# EAGLE schematic Sensor Gabung (EAGLE 7.2.0)

## Sheet 1 of 9
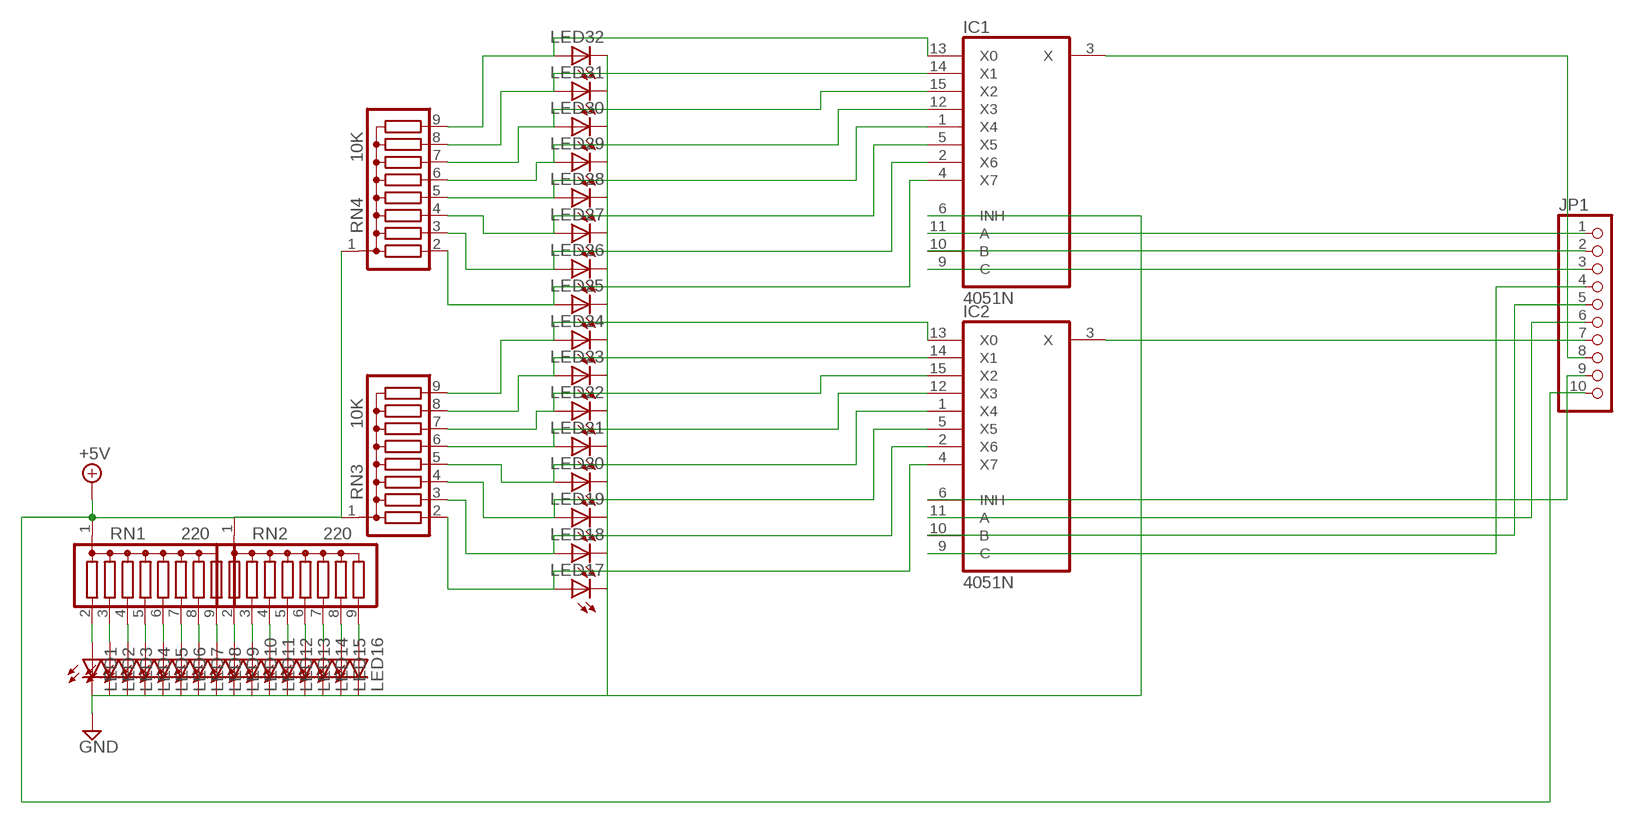
[diagram p0: schematic, sheet 1]

### Parts
IC1  4051N  [DIL16]
IC2  4051N  [DIL16]
JP1  PINHD-1X10  [1X10]
LED1  LED3MM  [LED3MM]
LED2  LED3MM  [LED3MM]
LED3  LED3MM  [LED3MM]
LED4  LED3MM  [LED3MM]
LED5  LED3MM  [LED3MM]
LED6  LED3MM  [LED3MM]
LED7  LED3MM  [LED3MM]
LED8  LED3MM  [LED3MM]
LED9  LED3MM  [LED3MM]
LED10  LED3MM  [LED3MM]
LED11  LED3MM  [LED3MM]
LED12  LED3MM  [LED3MM]
LED13  LED3MM  [LED3MM]
LED14  LED3MM  [LED3MM]
LED15  LED3MM  [LED3MM]
LED16  LED3MM  [LED3MM]
LED17  LED3MM  [LED3MM]
LED18  LED3MM  [LED3MM]
LED19  LED3MM  [LED3MM]
LED20  LED3MM  [LED3MM]
LED21  LED3MM  [LED3MM]
LED22  LED3MM  [LED3MM]
LED23  LED3MM  [LED3MM]
LED24  LED3MM  [LED3MM]
LED25  LED3MM  [LED3MM]
LED26  LED3MM  [LED3MM]
LED27  LED3MM  [LED3MM]
LED28  LED3MM  [LED3MM]
LED29  LED3MM  [LED3MM]
LED30  LED3MM  [LED3MM]
LED31  LED3MM  [LED3MM]
LED32  LED3MM  [LED3MM]
RN1  220  G08R  [SIL9]
RN2  220  G08R  [SIL9]
RN3  10K  G08R  [SIL9]
RN4  10K  G08R  [SIL9]

### Nets
+5V: JP1.10 RN1.1 RN2.1 RN3.1 RN4.1 ; also sheet 2,7,8,9
GND: IC1.6(INH) IC2.6(INH) JP1.9 LED1.K(C) LED2.K(C) LED3.K(C) LED4.K(C) LED5.K(C) LED6.K(C) LED7.K(C) LED8.K(C) LED9.K(C) LED10.K(C) LED11.K(C) LED12.K(C) LED13.K(C) LED14.K(C) LED15.K(C) LED16.K(C) LED17.K(C) LED18.K(C) LED19.K(C) LED20.K(C) LED21.K(C) LED22.K(C) LED23.K(C) LED24.K(C) LED25.K(C) LED26.K(C) LED27.K(C) LED28.K(C) LED29.K(C) LED30.K(C) LED31.K(C) LED32.K(C) ; also sheet 2,7,9
N$1: IC1.10(B) JP1.2
N$2: IC1.9(C) JP1.3
N$3: IC2.11(A) JP1.6
N$4: IC2.10(B) JP1.5
N$5: IC2.9(C) JP1.4
N$6: IC2.3(X) JP1.7
N$15: LED1.A RN1.2
N$16: LED2.A RN1.3
N$17: IC2.4(X7) LED17.A RN3.2
N$18: IC2.2(X6) LED18.A RN3.3
N$19: IC2.5(X5) LED19.A RN3.4
N$20: IC2.1(X4) LED20.A RN3.5
N$21: IC2.12(X3) LED21.A RN3.6
N$22: IC2.15(X2) LED22.A RN3.7
N$23: IC2.14(X1) LED23.A RN3.8
N$24: IC2.13(X0) LED24.A RN3.9
N$25: IC1.4(X7) LED25.A RN4.2
N$26: IC1.2(X6) LED26.A RN4.3
N$27: IC1.5(X5) LED27.A RN4.4
N$28: IC1.1(X4) LED28.A RN4.5
N$29: IC1.12(X3) LED29.A RN4.6
N$30: IC1.15(X2) LED30.A RN4.7
N$31: IC1.14(X1) LED31.A RN4.8
N$32: IC1.13(X0) LED32.A RN4.9
N$33: LED3.A RN1.4
N$34: LED4.A RN1.5
N$35: LED5.A RN1.6
N$36: LED6.A RN1.7
N$37: LED7.A RN1.8
N$38: LED8.A RN1.9
N$39: LED9.A RN2.2
N$40: LED10.A RN2.3
N$41: LED11.A RN2.4
N$42: LED12.A RN2.5
N$43: LED13.A RN2.6
N$44: LED14.A RN2.7
N$45: LED15.A RN2.8
N$46: LED16.A RN2.9
N$47: IC1.3(X) JP1.8
N$49: IC1.11(A) JP1.1

## Sheet 2 of 9
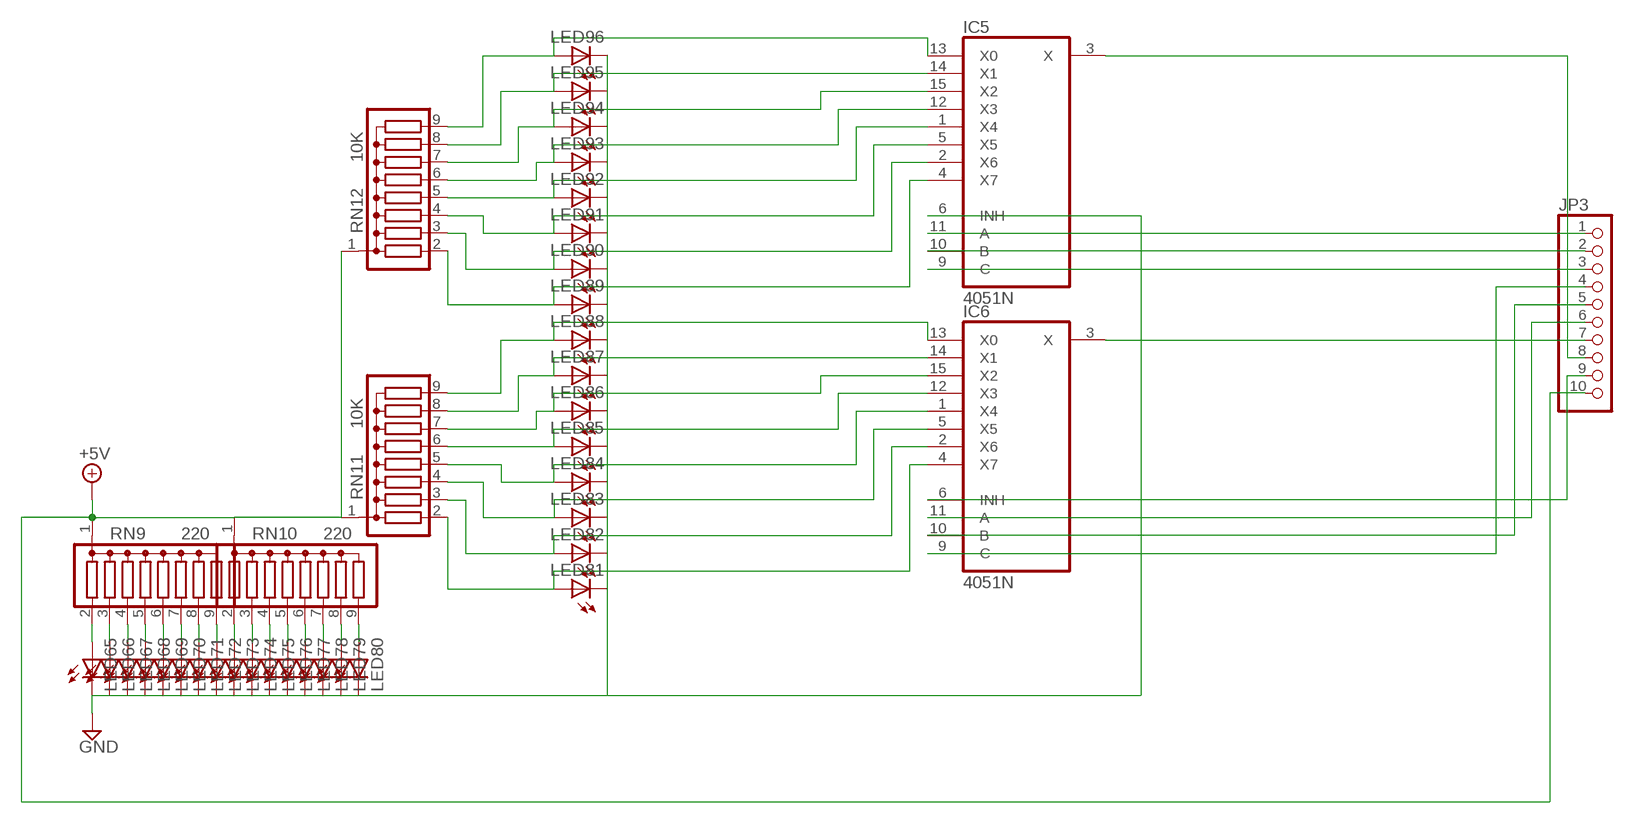
[diagram p1: schematic, sheet 2]

### Parts
IC5  4051N  [DIL16]
IC6  4051N  [DIL16]
JP3  PINHD-1X10  [1X10]
LED65  LED3MM  [LED3MM]
LED66  LED3MM  [LED3MM]
LED67  LED3MM  [LED3MM]
LED68  LED3MM  [LED3MM]
LED69  LED3MM  [LED3MM]
LED70  LED3MM  [LED3MM]
LED71  LED3MM  [LED3MM]
LED72  LED3MM  [LED3MM]
LED73  LED3MM  [LED3MM]
LED74  LED3MM  [LED3MM]
LED75  LED3MM  [LED3MM]
LED76  LED3MM  [LED3MM]
LED77  LED3MM  [LED3MM]
LED78  LED3MM  [LED3MM]
LED79  LED3MM  [LED3MM]
LED80  LED3MM  [LED3MM]
LED81  LED3MM  [LED3MM]
LED82  LED3MM  [LED3MM]
LED83  LED3MM  [LED3MM]
LED84  LED3MM  [LED3MM]
LED85  LED3MM  [LED3MM]
LED86  LED3MM  [LED3MM]
LED87  LED3MM  [LED3MM]
LED88  LED3MM  [LED3MM]
LED89  LED3MM  [LED3MM]
LED90  LED3MM  [LED3MM]
LED91  LED3MM  [LED3MM]
LED92  LED3MM  [LED3MM]
LED93  LED3MM  [LED3MM]
LED94  LED3MM  [LED3MM]
LED95  LED3MM  [LED3MM]
LED96  LED3MM  [LED3MM]
RN9  220  G08R  [SIL9]
RN10  220  G08R  [SIL9]
RN11  10K  G08R  [SIL9]
RN12  10K  G08R  [SIL9]

### Nets
+5V: JP3.10 RN9.1 RN10.1 RN11.1 RN12.1 ; also sheet 1,7,8,9
GND: IC5.6(INH) IC6.6(INH) JP3.9 LED65.K(C) LED66.K(C) LED67.K(C) LED68.K(C) LED69.K(C) LED70.K(C) LED71.K(C) LED72.K(C) LED73.K(C) LED74.K(C) LED75.K(C) LED76.K(C) LED77.K(C) LED78.K(C) LED79.K(C) LED80.K(C) LED81.K(C) LED82.K(C) LED83.K(C) LED84.K(C) LED85.K(C) LED86.K(C) LED87.K(C) LED88.K(C) LED89.K(C) LED90.K(C) LED91.K(C) LED92.K(C) LED93.K(C) LED94.K(C) LED95.K(C) LED96.K(C) ; also sheet 1,7,9
N$86: IC6.4(X7) LED81.A RN11.2
N$87: IC6.2(X6) LED82.A RN11.3
N$88: IC6.5(X5) LED83.A RN11.4
N$89: IC6.1(X4) LED84.A RN11.5
N$90: IC6.12(X3) LED85.A RN11.6
N$95: IC6.15(X2) LED86.A RN11.7
N$96: IC6.14(X1) LED87.A RN11.8
N$97: IC6.13(X0) LED88.A RN11.9
N$98: IC5.4(X7) LED89.A RN12.2
N$99: IC5.2(X6) LED90.A RN12.3
N$100: IC5.5(X5) LED91.A RN12.4
N$101: IC5.1(X4) LED92.A RN12.5
N$102: IC5.12(X3) LED93.A RN12.6
N$103: IC5.15(X2) LED94.A RN12.7
N$104: IC5.14(X1) LED95.A RN12.8
N$105: IC5.13(X0) LED96.A RN12.9
N$106: LED65.A RN9.2
N$107: LED66.A RN9.3
N$108: LED67.A RN9.4
N$109: LED68.A RN9.5
N$110: LED69.A RN9.6
N$111: LED70.A RN9.7
N$112: LED71.A RN9.8
N$113: LED72.A RN9.9
N$114: LED73.A RN10.2
N$115: LED74.A RN10.3
N$116: LED75.A RN10.4
N$117: LED76.A RN10.5
N$118: LED77.A RN10.6
N$119: LED78.A RN10.7
N$120: LED79.A RN10.8
N$121: LED80.A RN10.9
N$122: IC5.3(X) JP3.8
N$123: IC5.11(A) JP3.1
N$124: IC5.10(B) JP3.2
N$125: IC5.9(C) JP3.3
N$126: IC6.11(A) JP3.6
N$127: IC6.10(B) JP3.5
N$128: IC6.9(C) JP3.4
N$129: IC6.3(X) JP3.7

## Sheet 3 of 9
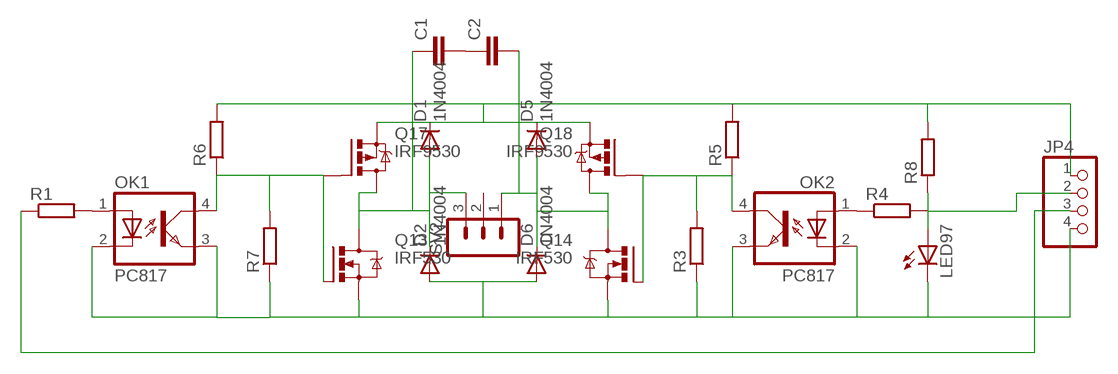
[diagram p2: schematic, sheet 3]

### Parts
C1  C-EU025-025X050  [C025-025X050]
C2  C-EU025-025X050  [C025-025X050]
D1  1N4004  [DO41-10]
D2  1N4004  [DO41-10]
D5  1N4004  [DO41-10]
D6  1N4004  [DO41-10]
JP4  PINHD-1X4  [1X04]
LED97  LED3MM  [LED3MM]
OK1  PC817  [DIL04]
OK2  PC817  [DIL04]
Q13  IRF530  [TO220BV]
Q14  IRF530  [TO220BV]
Q17  IRF9530  [TO220BV]
Q18  IRF9530  [TO220BV]
R1  R-EU_0207/10  [0207/10]
R3  R-EU_0204/7  [0204/7]
R4  R-EU_0207/10  [0207/10]
R5  R-EU_0207/10  [0207/10]
R6  R-EU_0207/10  [0207/10]
R7  R-EU_0204/7  [0204/7]
R8  R-EU_0207/10  [0207/10]
SV2  MA03-1  [MA03-1]

### Nets
+12V: D1.C D5.C JP4.1 Q17.S Q18.S R5.2 R6.2 R8.2
GND1: D2.A D6.A JP4.4 LED97.K(C) OK1.2(C) OK1.3(EMIT) OK2.2(C) OK2.3(EMIT) Q13.S Q14.S R3.1 R7.1 ; also sheet 8
N$132: C2.2 D5.A D6.C Q14.D Q18.D SV2.1
N$133: C1.1 D1.A D2.C Q13.D Q17.D SV2.3
N$134: OK2.4(COL) Q14.G Q18.G R3.2 R5.1
N$135: OK1.4(COL) Q13.G Q17.G R6.1 R7.2
N$136: LED97.A R8.1
N$137: OK2.1(A) R4.1
N$138: OK1.1(A) R1.2
N$139: C1.2 C2.1
PWM1: JP4.2 R4.2
PWM2: JP4.3 R1.1
Unconnected: SV2.2

## Sheet 4 of 9
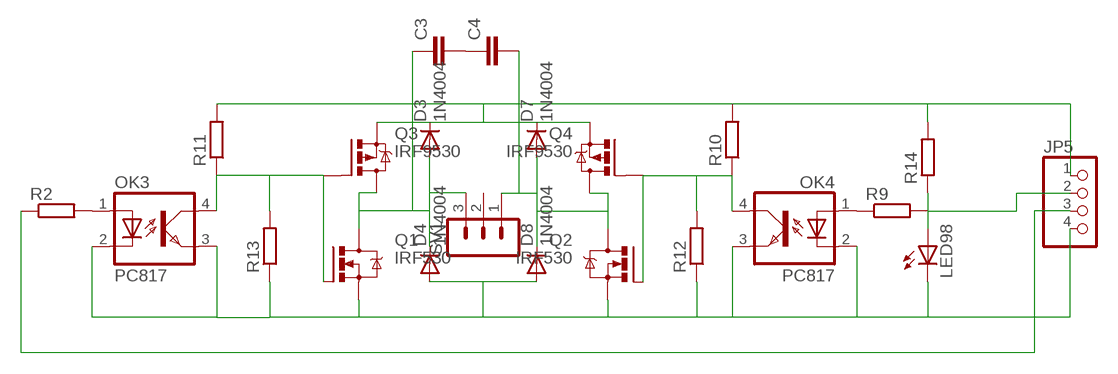
[diagram p3: schematic, sheet 4]

### Parts
C3  C-EU025-025X050  [C025-025X050]
C4  C-EU025-025X050  [C025-025X050]
D3  1N4004  [DO41-10]
D4  1N4004  [DO41-10]
D7  1N4004  [DO41-10]
D8  1N4004  [DO41-10]
JP5  PINHD-1X4  [1X04]
LED98  LED3MM  [LED3MM]
OK3  PC817  [DIL04]
OK4  PC817  [DIL04]
Q1  IRF530  [TO220BV]
Q2  IRF530  [TO220BV]
Q3  IRF9530  [TO220BV]
Q4  IRF9530  [TO220BV]
R2  R-EU_0207/10  [0207/10]
R9  R-EU_0207/10  [0207/10]
R10  R-EU_0207/10  [0207/10]
R11  R-EU_0207/10  [0207/10]
R12  R-EU_0204/7  [0204/7]
R13  R-EU_0204/7  [0204/7]
R14  R-EU_0207/10  [0207/10]
SV1  MA03-1  [MA03-1]

### Nets
+12V1: D3.C D7.C JP5.1 Q3.S Q4.S R10.2 R11.2 R14.2
GND2: D4.A D8.A JP5.4 LED98.K(C) OK3.2(C) OK3.3(EMIT) OK4.2(C) OK4.3(EMIT) Q1.S Q2.S R12.1 R13.1
N$141: C4.2 D7.A D8.C Q2.D Q4.D SV1.1
N$142: C3.1 D3.A D4.C Q1.D Q3.D SV1.3
N$143: OK4.4(COL) Q2.G Q4.G R10.1 R12.2
N$144: OK3.4(COL) Q1.G Q3.G R11.1 R13.2
N$145: LED98.A R14.1
N$146: OK4.1(A) R9.1
N$147: OK3.1(A) R2.2
N$148: C3.2 C4.1
PWM3: JP5.3 R2.1
PWM4: JP5.2 R9.2
Unconnected: SV1.2

## Sheet 5 of 9
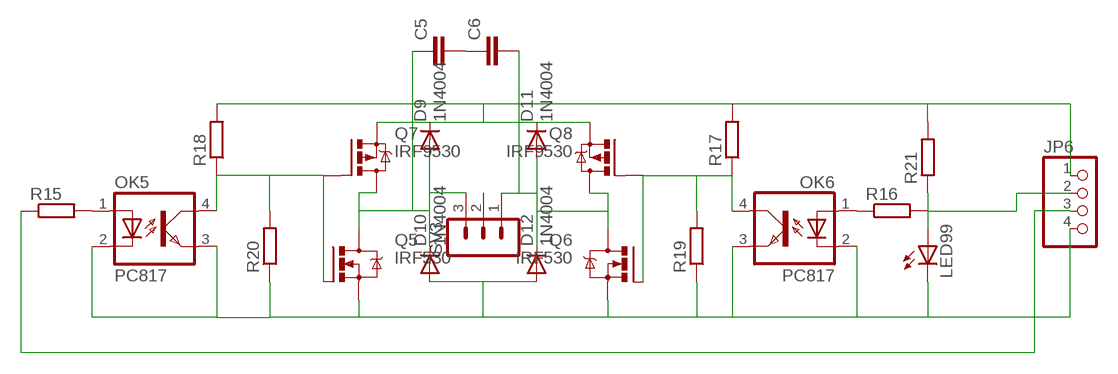
[diagram p4: schematic, sheet 5]

### Parts
C5  C-EU025-025X050  [C025-025X050]
C6  C-EU025-025X050  [C025-025X050]
D9  1N4004  [DO41-10]
D10  1N4004  [DO41-10]
D11  1N4004  [DO41-10]
D12  1N4004  [DO41-10]
JP6  PINHD-1X4  [1X04]
LED99  LED3MM  [LED3MM]
OK5  PC817  [DIL04]
OK6  PC817  [DIL04]
Q5  IRF530  [TO220BV]
Q6  IRF530  [TO220BV]
Q7  IRF9530  [TO220BV]
Q8  IRF9530  [TO220BV]
R15  R-EU_0207/10  [0207/10]
R16  R-EU_0207/10  [0207/10]
R17  R-EU_0207/10  [0207/10]
R18  R-EU_0207/10  [0207/10]
R19  R-EU_0204/7  [0204/7]
R20  R-EU_0204/7  [0204/7]
R21  R-EU_0207/10  [0207/10]
SV3  MA03-1  [MA03-1]

### Nets
+12V2: D9.C D11.C JP6.1 Q7.S Q8.S R17.2 R18.2 R21.2
GND3: D10.A D12.A JP6.4 LED99.K(C) OK5.2(C) OK5.3(EMIT) OK6.2(C) OK6.3(EMIT) Q5.S Q6.S R19.1 R20.1
N$150: C6.2 D11.A D12.C Q6.D Q8.D SV3.1
N$151: C5.1 D9.A D10.C Q5.D Q7.D SV3.3
N$152: OK6.4(COL) Q6.G Q8.G R17.1 R19.2
N$153: OK5.4(COL) Q5.G Q7.G R18.1 R20.2
N$154: LED99.A R21.1
N$155: OK6.1(A) R16.1
N$156: OK5.1(A) R15.2
N$157: C5.2 C6.1
PWM5: JP6.3 R15.1
PWM6: JP6.2 R16.2
Unconnected: SV3.2

## Sheet 6 of 9
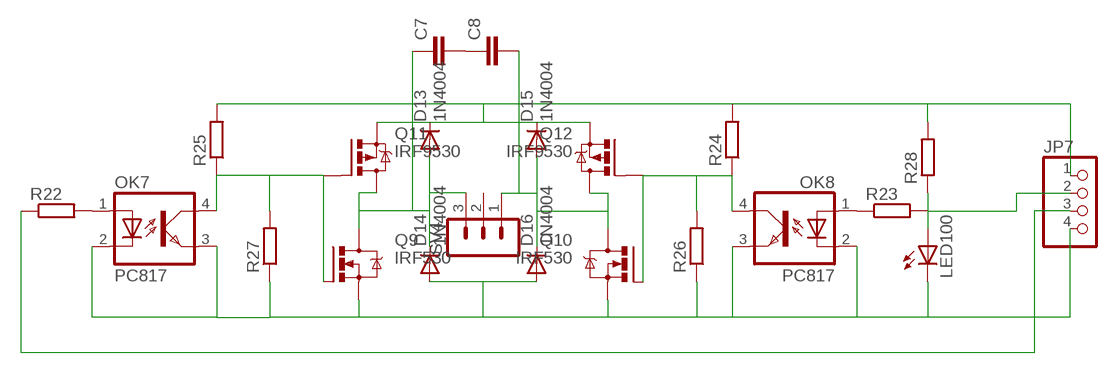
[diagram p5: schematic, sheet 6]

### Parts
C7  C-EU025-025X050  [C025-025X050]
C8  C-EU025-025X050  [C025-025X050]
D13  1N4004  [DO41-10]
D14  1N4004  [DO41-10]
D15  1N4004  [DO41-10]
D16  1N4004  [DO41-10]
JP7  PINHD-1X4  [1X04]
LED100  LED3MM  [LED3MM]
OK7  PC817  [DIL04]
OK8  PC817  [DIL04]
Q9  IRF530  [TO220BV]
Q10  IRF530  [TO220BV]
Q11  IRF9530  [TO220BV]
Q12  IRF9530  [TO220BV]
R22  R-EU_0207/10  [0207/10]
R23  R-EU_0207/10  [0207/10]
R24  R-EU_0207/10  [0207/10]
R25  R-EU_0207/10  [0207/10]
R26  R-EU_0204/7  [0204/7]
R27  R-EU_0204/7  [0204/7]
R28  R-EU_0207/10  [0207/10]
SV4  MA03-1  [MA03-1]

### Nets
+12V3: D13.C D15.C JP7.1 Q11.S Q12.S R24.2 R25.2 R28.2
GND4: D14.A D16.A JP7.4 LED100.K(C) OK7.2(C) OK7.3(EMIT) OK8.2(C) OK8.3(EMIT) Q9.S Q10.S R26.1 R27.1
N$159: C8.2 D15.A D16.C Q10.D Q12.D SV4.1
N$160: C7.1 D13.A D14.C Q9.D Q11.D SV4.3
N$161: OK8.4(COL) Q10.G Q12.G R24.1 R26.2
N$162: OK7.4(COL) Q9.G Q11.G R25.1 R27.2
N$163: LED100.A R28.1
N$164: OK8.1(A) R23.1
N$165: OK7.1(A) R22.2
N$166: C7.2 C8.1
PWM7: JP7.3 R22.1
PWM8: JP7.2 R23.2
Unconnected: SV4.2

## Sheet 7 of 9
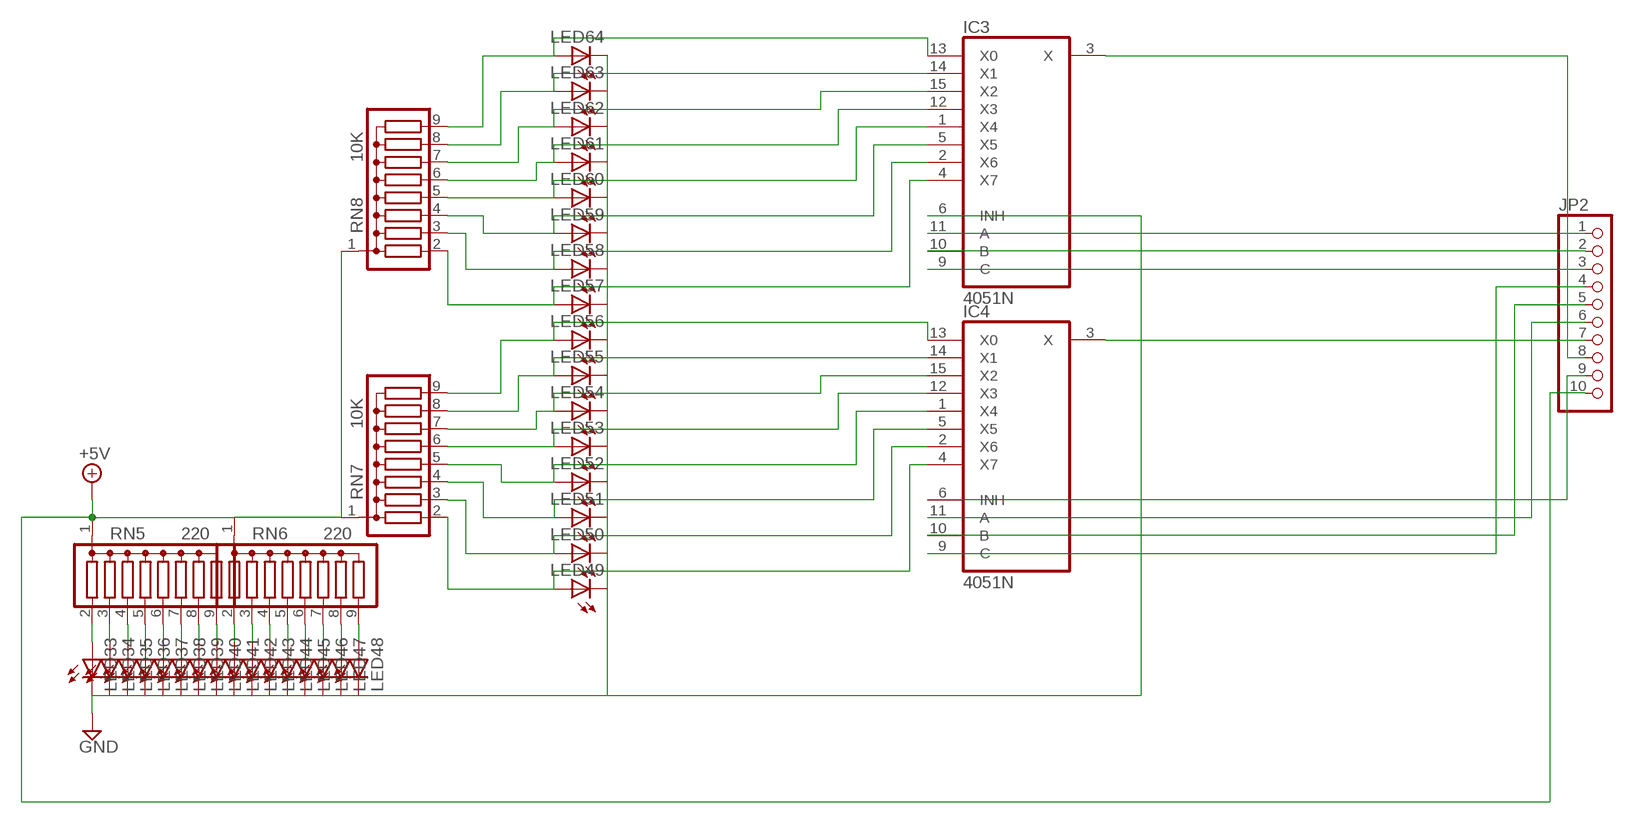
[diagram p6: schematic, sheet 7]

### Parts
IC3  4051N  [DIL16]
IC4  4051N  [DIL16]
JP2  PINHD-1X10  [1X10]
LED33  LED3MM  [LED3MM]
LED34  LED3MM  [LED3MM]
LED35  LED3MM  [LED3MM]
LED36  LED3MM  [LED3MM]
LED37  LED3MM  [LED3MM]
LED38  LED3MM  [LED3MM]
LED39  LED3MM  [LED3MM]
LED40  LED3MM  [LED3MM]
LED41  LED3MM  [LED3MM]
LED42  LED3MM  [LED3MM]
LED43  LED3MM  [LED3MM]
LED44  LED3MM  [LED3MM]
LED45  LED3MM  [LED3MM]
LED46  LED3MM  [LED3MM]
LED47  LED3MM  [LED3MM]
LED48  LED3MM  [LED3MM]
LED49  LED3MM  [LED3MM]
LED50  LED3MM  [LED3MM]
LED51  LED3MM  [LED3MM]
LED52  LED3MM  [LED3MM]
LED53  LED3MM  [LED3MM]
LED54  LED3MM  [LED3MM]
LED55  LED3MM  [LED3MM]
LED56  LED3MM  [LED3MM]
LED57  LED3MM  [LED3MM]
LED58  LED3MM  [LED3MM]
LED59  LED3MM  [LED3MM]
LED60  LED3MM  [LED3MM]
LED61  LED3MM  [LED3MM]
LED62  LED3MM  [LED3MM]
LED63  LED3MM  [LED3MM]
LED64  LED3MM  [LED3MM]
RN5  220  G08R  [SIL9]
RN6  220  G08R  [SIL9]
RN7  10K  G08R  [SIL9]
RN8  10K  G08R  [SIL9]

### Nets
+5V: JP2.10 RN5.1 RN6.1 RN7.1 RN8.1 ; also sheet 1,2,8,9
GND: IC3.6(INH) IC4.6(INH) JP2.9 LED33.K(C) LED34.K(C) LED35.K(C) LED36.K(C) LED37.K(C) LED38.K(C) LED39.K(C) LED40.K(C) LED41.K(C) LED42.K(C) LED43.K(C) LED44.K(C) LED45.K(C) LED46.K(C) LED47.K(C) LED48.K(C) LED49.K(C) LED50.K(C) LED51.K(C) LED52.K(C) LED53.K(C) LED54.K(C) LED55.K(C) LED56.K(C) LED57.K(C) LED58.K(C) LED59.K(C) LED60.K(C) LED61.K(C) LED62.K(C) LED63.K(C) LED64.K(C) ; also sheet 1,2,9
N$7: IC4.4(X7) LED49.A RN7.2
N$8: IC4.2(X6) LED50.A RN7.3
N$9: IC4.5(X5) LED51.A RN7.4
N$10: IC4.1(X4) LED52.A RN7.5
N$11: IC4.12(X3) LED53.A RN7.6
N$12: IC4.15(X2) LED54.A RN7.7
N$13: IC4.14(X1) LED55.A RN7.8
N$14: IC4.13(X0) LED56.A RN7.9
N$48: IC3.4(X7) LED57.A RN8.2
N$50: IC3.2(X6) LED58.A RN8.3
N$51: IC3.5(X5) LED59.A RN8.4
N$52: IC3.1(X4) LED60.A RN8.5
N$53: IC3.12(X3) LED61.A RN8.6
N$54: IC3.15(X2) LED62.A RN8.7
N$55: IC3.14(X1) LED63.A RN8.8
N$56: IC3.13(X0) LED64.A RN8.9
N$57: LED33.A RN5.2
N$58: LED34.A RN5.3
N$59: LED35.A RN5.4
N$60: LED36.A RN5.5
N$61: LED37.A RN5.6
N$62: LED38.A RN5.7
N$63: LED39.A RN5.8
N$64: LED40.A RN5.9
N$65: LED41.A RN6.2
N$66: LED42.A RN6.3
N$67: LED43.A RN6.4
N$68: LED44.A RN6.5
N$69: LED45.A RN6.6
N$70: LED46.A RN6.7
N$71: LED47.A RN6.8
N$72: LED48.A RN6.9
N$73: IC3.3(X) JP2.8
N$74: IC3.11(A) JP2.1
N$75: IC3.10(B) JP2.2
N$76: IC3.9(C) JP2.3
N$77: IC4.11(A) JP2.6
N$78: IC4.10(B) JP2.5
N$79: IC4.9(C) JP2.4
N$80: IC4.3(X) JP2.7

## Sheet 8 of 9
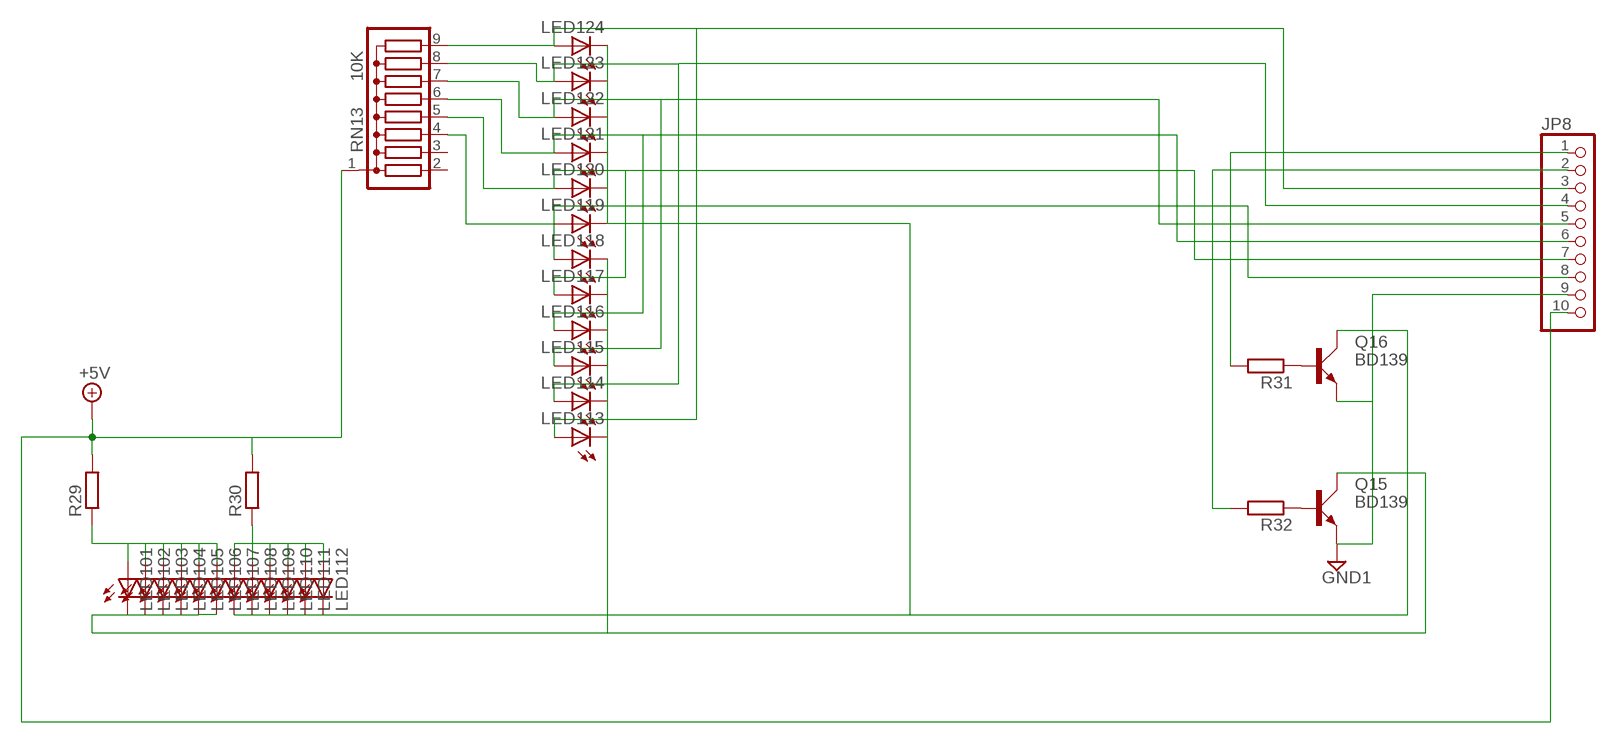
[diagram p7: schematic, sheet 8]

### Parts
JP8  PINHD-1X10  [1X10]
LED101  LED3MM  [LED3MM]
LED102  LED3MM  [LED3MM]
LED103  LED3MM  [LED3MM]
LED104  LED3MM  [LED3MM]
LED105  LED3MM  [LED3MM]
LED106  LED3MM  [LED3MM]
LED107  LED3MM  [LED3MM]
LED108  LED3MM  [LED3MM]
LED109  LED3MM  [LED3MM]
LED110  LED3MM  [LED3MM]
LED111  LED3MM  [LED3MM]
LED112  LED3MM  [LED3MM]
LED113  LED3MM  [LED3MM]
LED114  LED3MM  [LED3MM]
LED115  LED3MM  [LED3MM]
LED116  LED3MM  [LED3MM]
LED117  LED3MM  [LED3MM]
LED118  LED3MM  [LED3MM]
LED119  LED3MM  [LED3MM]
LED120  LED3MM  [LED3MM]
LED121  LED3MM  [LED3MM]
LED122  LED3MM  [LED3MM]
LED123  LED3MM  [LED3MM]
LED124  LED3MM  [LED3MM]
Q15  BD139  [TO126AV]
Q16  BD139  [TO126AV]
R29  R-EU_0207/10  [0207/10]
R30  R-EU_0207/10  [0207/10]
R31  R-EU_0207/10  [0207/10]
R32  R-EU_0207/10  [0207/10]
RN13  10K  G08R  [SIL9]

### Nets
+5V: JP8.10 R29.2 R30.2 RN13.1 ; also sheet 1,2,7,9
GND1: JP8.9 Q15.E Q16.E ; also sheet 3
N$84: LED101.A LED102.A LED103.A LED104.A LED105.A LED106.A R29.1
N$85: LED107.A LED108.A LED109.A LED110.A LED111.A LED112.A R30.1
N$168: JP8.8 LED118.A LED119.A RN13.4
N$169: JP8.6 LED116.A LED121.A RN13.6
N$170: JP8.5 LED115.A LED122.A RN13.7
N$171: JP8.4 LED114.A LED123.A RN13.8
N$172: JP8.3 LED113.A LED124.A RN13.9
N$173: LED107.K(C) LED108.K(C) LED109.K(C) LED110.K(C) LED111.K(C) LED112.K(C) LED119.K(C) LED120.K(C) LED121.K(C) LED122.K(C) LED123.K(C) LED124.K(C) Q16.C
N$174: LED101.K(C) LED102.K(C) LED103.K(C) LED104.K(C) LED105.K(C) LED106.K(C) LED113.K(C) LED114.K(C) LED115.K(C) LED116.K(C) LED117.K(C) LED118.K(C) Q15.C
N$175: Q16.B R31.1
N$176: Q15.B R32.1
N$177: JP8.1 R31.2
N$178: JP8.2 R32.2
N$179: JP8.7 LED117.A LED120.A RN13.5
Unconnected: RN13.2 RN13.3

## Sheet 9 of 9
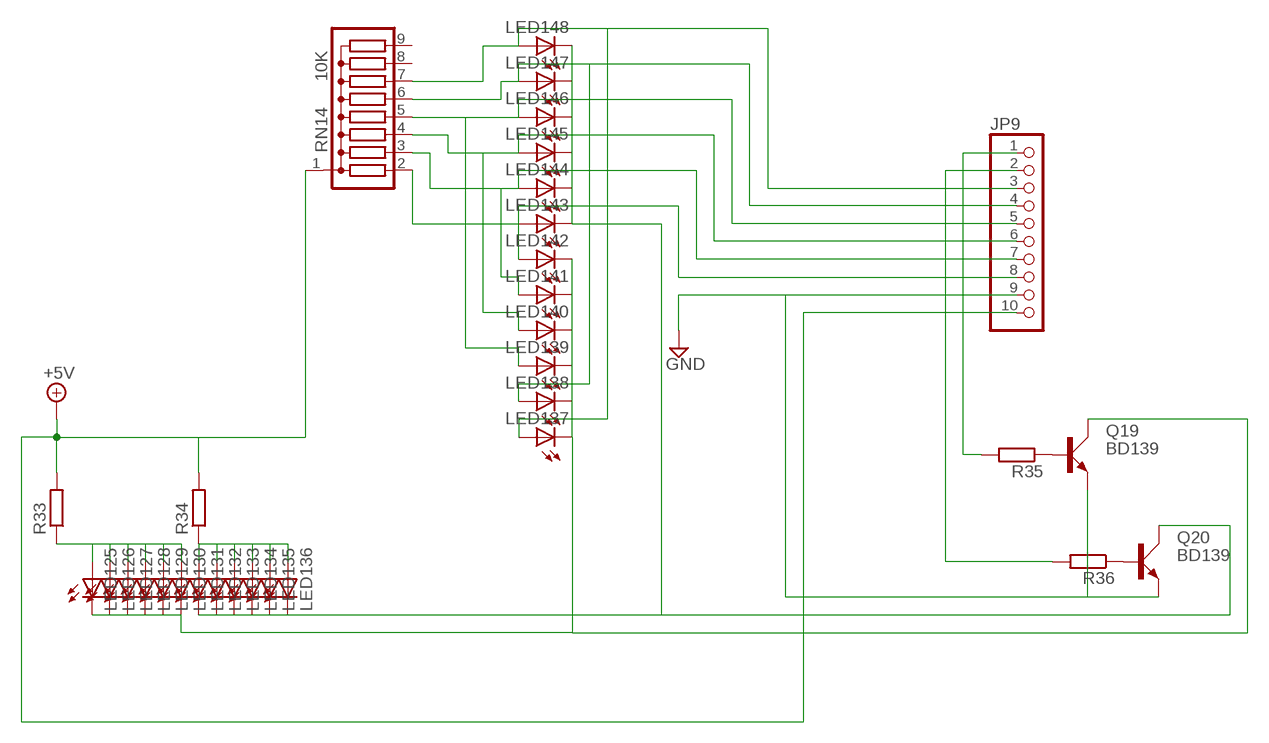
[diagram p8: schematic, sheet 9]

### Parts
JP9  PINHD-1X10  [1X10]
LED125  LED3MM  [LED3MM]
LED126  LED3MM  [LED3MM]
LED127  LED3MM  [LED3MM]
LED128  LED3MM  [LED3MM]
LED129  LED3MM  [LED3MM]
LED130  LED3MM  [LED3MM]
LED131  LED3MM  [LED3MM]
LED132  LED3MM  [LED3MM]
LED133  LED3MM  [LED3MM]
LED134  LED3MM  [LED3MM]
LED135  LED3MM  [LED3MM]
LED136  LED3MM  [LED3MM]
LED137  LED3MM  [LED3MM]
LED138  LED3MM  [LED3MM]
LED139  LED3MM  [LED3MM]
LED140  LED3MM  [LED3MM]
LED141  LED3MM  [LED3MM]
LED142  LED3MM  [LED3MM]
LED143  LED3MM  [LED3MM]
LED144  LED3MM  [LED3MM]
LED145  LED3MM  [LED3MM]
LED146  LED3MM  [LED3MM]
LED147  LED3MM  [LED3MM]
LED148  LED3MM  [LED3MM]
Q19  BD139  [TO126AV]
Q20  BD139  [TO126AV]
R33  R-EU_0204/7  [0204/7]
R34  R-EU_0204/7  [0204/7]
R35  R-EU_0204/7  [0204/7]
R36  R-EU_0204/7  [0204/7]
RN14  10K  G08R  [SIL9]

### Nets
+5V: JP9.10 R33.2 R34.2 RN14.1 ; also sheet 1,2,7,8
GND: JP9.9 Q19.E Q20.E ; also sheet 1,2,7
N$184: LED125.A LED126.A LED127.A LED128.A LED129.A LED130.A R33.1
N$185: JP9.7 LED141.A LED144.A RN14.3
N$186: JP9.6 LED140.A LED145.A RN14.4
N$187: JP9.5 LED139.A LED146.A RN14.5
N$188: JP9.4 LED138.A LED147.A RN14.6
N$189: JP9.3 LED137.A LED148.A RN14.7
N$190: LED131.A LED132.A LED133.A LED134.A LED135.A LED136.A R34.1
N$191: LED131.K(C) LED132.K(C) LED133.K(C) LED134.K(C) LED135.K(C) LED136.K(C) LED143.K(C) LED144.K(C) LED145.K(C) LED146.K(C) LED147.K(C) LED148.K(C) Q20.C
N$192: LED125.K(C) LED126.K(C) LED127.K(C) LED128.K(C) LED129.K(C) LED130.K(C) LED137.K(C) LED138.K(C) LED139.K(C) LED140.K(C) LED141.K(C) LED142.K(C) Q19.C
N$193: JP9.8 LED142.A LED143.A RN14.2
N$194: Q20.B R36.1
N$195: JP9.2 R36.2
N$196: JP9.1 R35.2
N$199: Q19.B R35.1
Unconnected: RN14.8 RN14.9

## Power pins joined to a net without a drawn wire
+5V: IC1.16(VCC) IC2.16(VCC) IC3.16(VCC) IC4.16(VCC) IC5.16(VCC) IC6.16(VCC)
GND: IC1.8(GND) IC2.8(GND) IC3.7(VEE) IC3.8(GND) IC4.7(VEE) IC4.8(GND) IC5.7(VEE) IC5.8(GND) IC6.7(VEE) IC6.8(GND)
VEE: IC1.7(VEE) IC2.7(VEE)

## Library data of the parts
C1-C8 = rcl:C-EU: CAPACITOR, European symbol
D1-D16 = diode:1N4004: DIODE general purpose rectifier, 1 A
IC1-IC6 = 40xx:4051: 8-channel ANALOG MULTIPLEXER
JP1-JP3 JP8 JP9 = pinhead:PINHD-1X10: PIN HEADER
JP4-JP7 = pinhead:PINHD-1X4: PIN HEADER
LED1-LED148 = led:LED: LED OSRAM: - CHIPLED LG R971, LG N971, LY N971, LG Q971, LY Q971, LO R971, LY R971 LH N974, LH R974 LS Q976, LO Q976, LY Q976 LO Q996 - Hyper CHIPLED LW Q18S LB Q993, LB Q99A, LB R99A - SideLED LS A670, LO A670, LY A670, LG A670, LP A670 LB A673, LV A673, LT A673, LW A673 LH A674 LY A675 LS A676, LA A676, LO A676, LY A676, LW A676 LS A679, LY A679, LG A679 - Hyper Micro SIDELED® LS Y876, LA Y876, LO Y876, LY Y876 LT Y87S - SmartLED LW L88C, LW L88S LB L89C, LB L89S, LG L890 LS L89K, LO L89K, LY L89K LS L896, LA L896, LO L896, LY L896 - TOPLED LS T670, LO T670, LY T670, LG T670, LP T670 LSG T670, LSP T670, LSY T670, LOP T670, LYG T670 LG T671, LOG T671, LSG T671 LB T673, LV T673, LT T673, LW T673 LH T674 LS T676, LA T676, LO T676, LY T676, LB T676, LH T676, LSB T676, LW T676 LB T67C, LV T67C, LT T67C, LS T67K, LO T67K, LY T67K, LW E67C LS E67B, LA E67B, LO E67B, LY E67B, LB E67C, LV E67C, LT E67C LW T67C LS T679, LY T679, LG T679 LS T770, LO T770, LY T770, LG T770, LP T770 LB T773, LV T773, LT T773, LW T773 LH T774 LS E675, LA E675, LY E675, LS T675 LS T776, LA T776, LO T776, LY T776, LB T776 LHGB T686 LT T68C, LB T68C - Hyper Mini TOPLED® LB M676 - Mini TOPLED Santana® LG M470 LS M47K, LO M47K, LY M47K Source: http://www.osram.convergy.de LUXEON: - LUMILED® LXK2-PW12-R00, LXK2-PW12-S00, LXK2-PW14-U00, LXK2-PW14-V00 LXK2-PM12-R00, LXK2-PM12-S00, LXK2-PM14-U00 LXK2-PE12-Q00, LXK2-PE12-R00, LXK2-PE12-S00, LXK2-PE14-T00, LXK2-PE14-U00 LXK2-PB12-K00, LXK2-PB12-L00, LXK2-PB12-M00, LXK2-PB14-N00, LXK2-PB14-P00, LXK2-PB14-Q00 LXK2-PR12-L00, LXK2-PR12-M00, LXK2-PR14-Q00, LXK2-PR14-R00 LXK2-PD12-Q00, LXK2-PD12-R00, LXK2-PD12-S00 LXK2-PH12-R00, LXK2-PH12-S00 LXK2-PL12-P00, LXK2-PL12-Q00, LXK2-PL12-R00 Source: www.luxeon.com KINGBRIGHT: KA-3528ASYC Source: www.kingbright.com
OK1-OK8 = optocoupler:PC817: SHARP OPTO COUPLER; MPN: PC817X4J000F; OC_FARNELL: 9707727; OC_NEWARK: 97K7059
Q1 Q2 Q5 Q6 Q9 Q10 Q13 Q14 = transistor-power:IRF530: HEXFET Power MOSFET
Q3 Q4 Q7 Q8 Q11 Q12 Q17 Q18 = transistor-power:IRF9530: P-CHANNEL HEXFET POWER-MOS-FET Source: http://www.irf.com/product-info/datasheets/data/irf9530.pdf
Q15 Q16 Q19 Q20 = transistor-power:BD139: NPN TRANSISTOR
R1-R36 = resistor:R-EU_: RESISTOR, European symbol
RN1-RN14 = resistor-sil:G08R: SIL RESISTOR
SV1-SV4 = con-lstb:MA03-1: PIN HEADER

## Net classes
0 default: width 0.051 mm, clearance 0.051 mm